# Altium schematic sheet LowPassFilter.SchDoc
size A; SheetNumber: 7; SheetTotal: 7
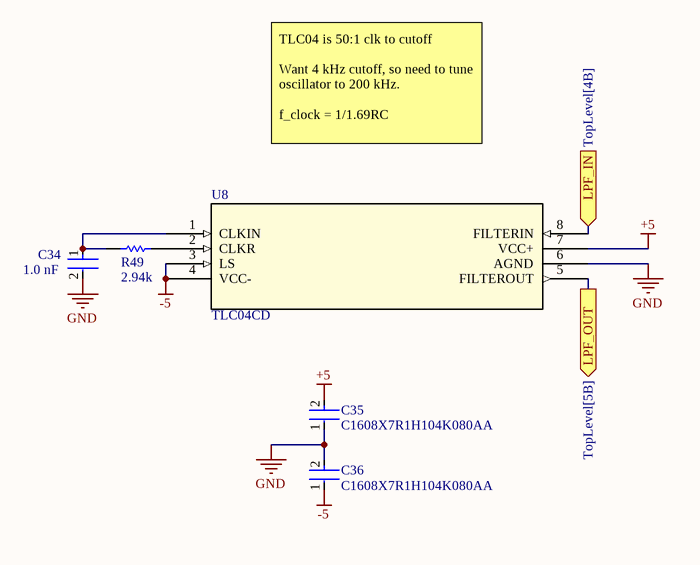
[diagram p0: LowPassFilter.SchDoc]

## Parts
C34  Capacitance: 1.0 nF  [FP-CC0603-DA-MFG]  (hidden comment: CC0603KRX7R9BB102)
C35  C1608X7R1H104K080AA  [FP-C1608-080-0_1-MFG]
C36  C1608X7R1H104K080AA  [FP-C1608-080-0_1-MFG]
R49  Resistance: 2.94k  [RESC1608X55X25ML10T15]  (hidden comment: RC0603FR-072K94L)
U8  TLC04CD  [D8]

## Ports
LPF_IN (in, see TopLevel[4B]), LPF_OUT (out, see TopLevel[5B])

## Nets
+5: C35.2 U8.7(VCC+)
-5: C36.1 U8.3(LS) U8.4(VCC-)
GND: C34.2 C35.1 C36.2 U8.6(AGND)
LPF_IN: U8.8(FILTERIN) ; port LPF_IN
LPF_OUT: U8.5(FILTEROUT) ; port LPF_OUT
NetC34_1: C34.1 R49.1 U8.1(CLKIN)
NetR49_2: R49.2 U8.2(CLKR)

## Notes on the sheet
- TLC04 is 50:1 clk to cutoff
  Want 4 kHz cutoff, so need to tune oscillator to 200 kHz.
  f_clock = 1/1.69RC

## Library data of the parts
C34 = CMP-2100-03599-2: CAP CER 1000PF 50V X7R 0603; Manufacturer: YAGEO; Material: Ceramic; Tolerance: 0.1; Description: CC0603 1.0 nF X7R 10.00% 50 V; Value: 1.0 nF; Temperature Coefficient: 15%; Device Class L3: Ceramic Capacitors; Automotive: No; Manufacturer Part Number: CC0603KRX7R9BB102; Digikey Description: CAP CER 1000PF 50V X7R 0603; Lead Free: Yes; Temperature Range High: +125°C; ComponentLink2URL: http://www.yageo.com/documents/recent/UPY-GPHC_X7R_6.3V-to-50V_18.pdf; Category: Cap; Footprint Url: http://www.yageo.com/exep/pages/download/literatures/UPY-C_GEN_24.pdf; RoHS: TRUE; Octopart: https://octopart.com/cc0603krx7r9bb102-yageo-192933; ComponentLink2Description: Datasheet; Device Class L2: Capacitors; Mouser Description: Multilayer Ceramic Capacitors MLCC - SMD/SMT 1.0nF 50V X7R 10%; Temperature Range Low: -55°C; Temperature Characteristic: X7R; Device Class L1: Passive Components; Temperature: -55°C to +125°C; Package: CC0603-DA; Voltage: 50 V; Voltage Rating: 50 V; Height: 0.9mm
C35 C36 = CMP-2000-04982-2: Multilayer Ceramic Capacitors 100nF ±10% 50V X7R SMD 0603; REACH SVHC: No SVHC; Voltage: 50V; Min Operating Temperature: -55°C; Package Quantity: 1; Case Code (Metric): 1608; Series: C; Termination: SMD/SMT; Length: 1.6mm; Voltage Rating: 50V; Case Code (Imperial): 0603; Number of Pins: 2; RoHS Compliant: Yes; Thickness: 0.037inch; Resistor Type: Ceramic; Radiation Hardening: No; Weight: 7.1E-05oz; Mount: Surface Mount; Capacitance: 100nF; Voltage Rating (DC): 50V; Construction: Flat; Tolerance: 10%; Lead Free: Lead Free; Case/Package: 0603; Max Operating Temperature: 125°C; Height: 0.8mm; Depth: 0.8mm; Packaging: Tape and Reel; Width: 0.031inch; Dielectric Material: Ceramic; Dielectric: X7R
R49 = CMP-1012-00561-2: Manufacturer: Yageo; Part Number: RC0603FR-072K94L
U8 = TLC04CD: No Description Available; Mfr_Name: Texas Instruments; RefDes: RefDes; Type: Type